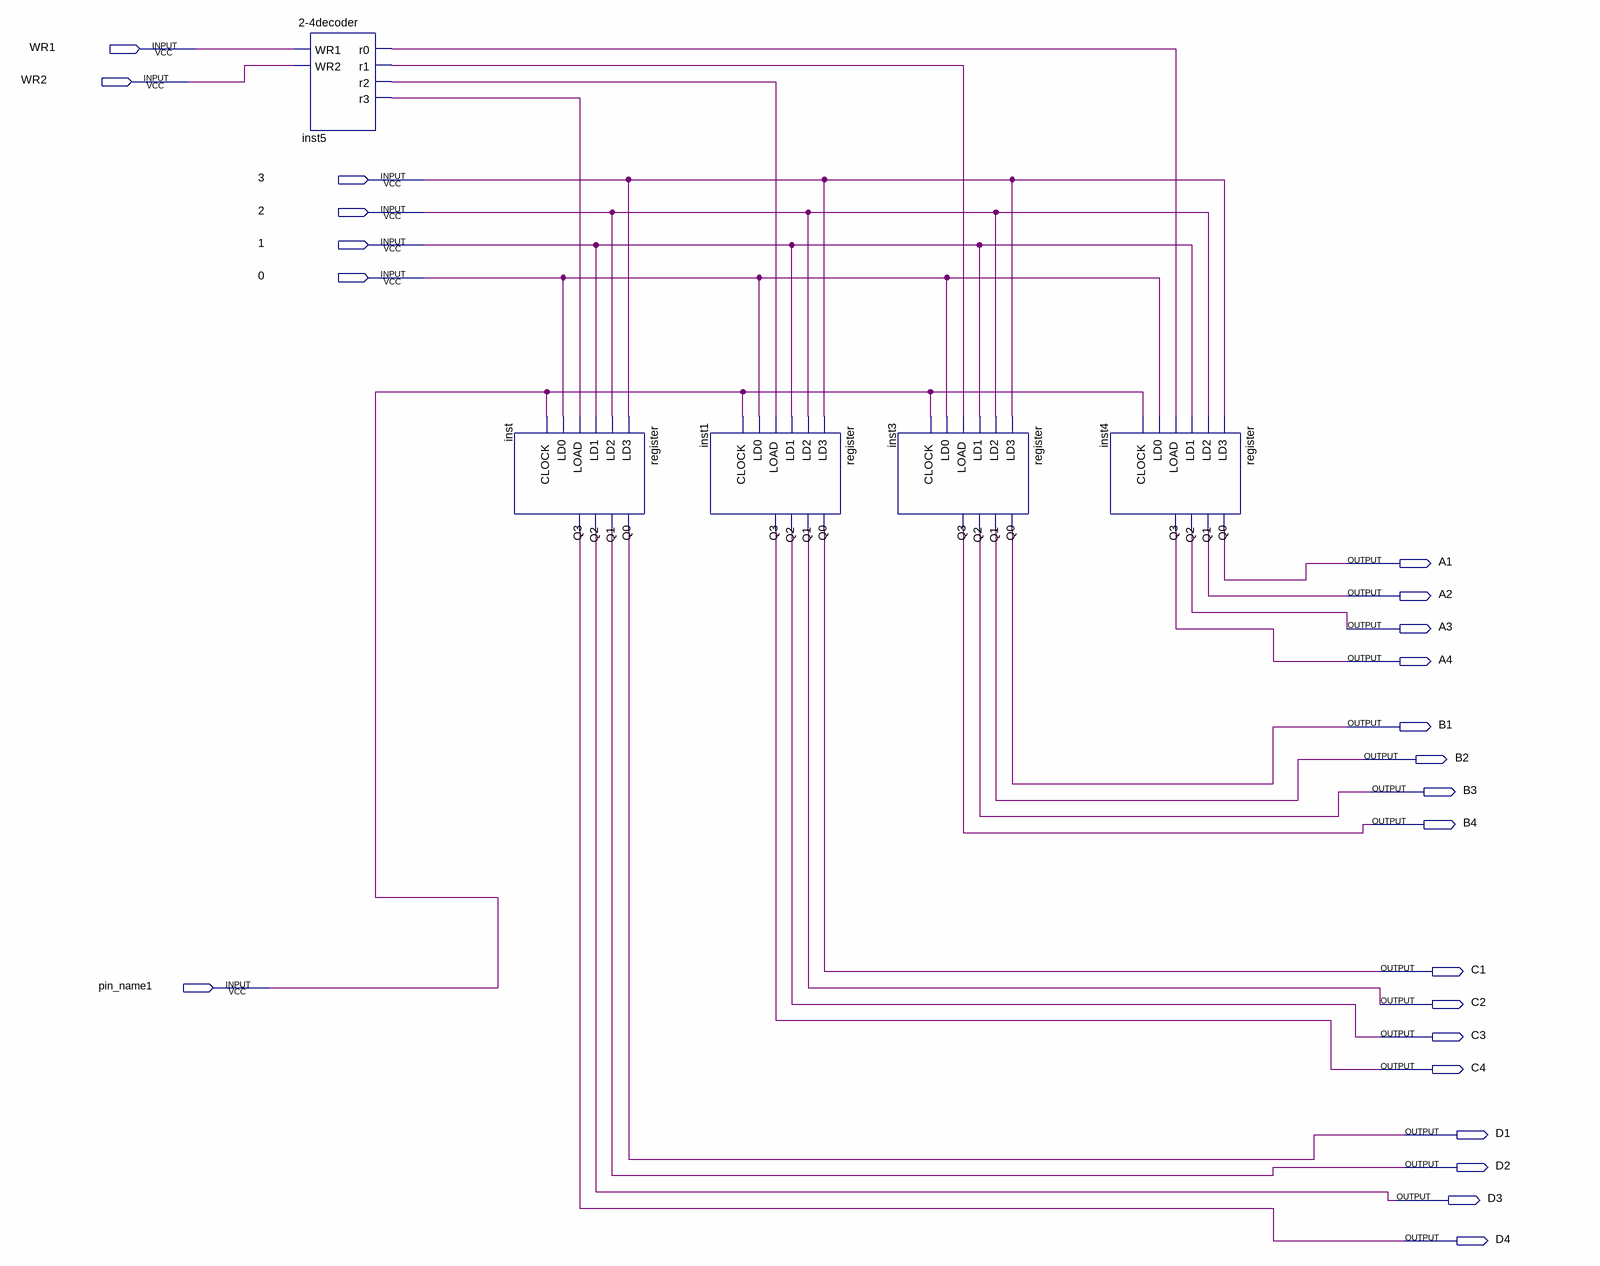
[diagram p0: schematic sheet]
// Quartus schematic random.bdf as structural Verilog: 5 symbols, 23 pins
module random (
  input  WR1,
  input  WR2,
  input  \3 ,
  input  \2 ,
  input  \1 ,
  input  \0 ,
  input  pin_name1,
  output A1,
  output A2,
  output A3,
  output A4,
  output B1,
  output B2,
  output B3,
  output B4,
  output C1,
  output C2,
  output C3,
  output C4,
  output D1,
  output D2,
  output D3,
  output D4
);

  wire inst5_r0, inst5_r1, inst5_r2, inst5_r3;

  \2-4decoder  inst5 (.WR1(WR1), .WR2(WR2), .r0(inst5_r0), .r1(inst5_r1), .r2(inst5_r2), .r3(inst5_r3));
  register inst (
    .LD3(\3 ), .LD2(\2 ), .LD1(\1 ), .LOAD(inst5_r3), .LD0(\0 ), .CLOCK(pin_name1), .Q0(D1), .Q1(D2),
    .Q2(D3), .Q3(D4));
  register inst1 (
    .LD3(\3 ), .LD2(\2 ), .LD1(\1 ), .LOAD(inst5_r2), .LD0(\0 ), .CLOCK(pin_name1), .Q0(C1), .Q1(C2),
    .Q2(C3), .Q3(C4));
  register inst3 (
    .LD3(\3 ), .LD2(\2 ), .LD1(\1 ), .LOAD(inst5_r1), .LD0(\0 ), .CLOCK(pin_name1), .Q0(B1), .Q1(B2),
    .Q2(B3), .Q3(B4));
  register inst4 (
    .LD3(\3 ), .LD2(\2 ), .LD1(\1 ), .LOAD(inst5_r0), .LD0(\0 ), .CLOCK(pin_name1), .Q0(A1), .Q1(A2),
    .Q2(A3), .Q3(A4));
endmodule
